# Altium schematic sheet COMS0013_Top_Schematic.SchDoc: Communications Top Level Schematic
size A3; Engineer: A. Shaw; DocumentNumber: COMS0013; Version: 1.0; Description: Overview of the communications subsystem
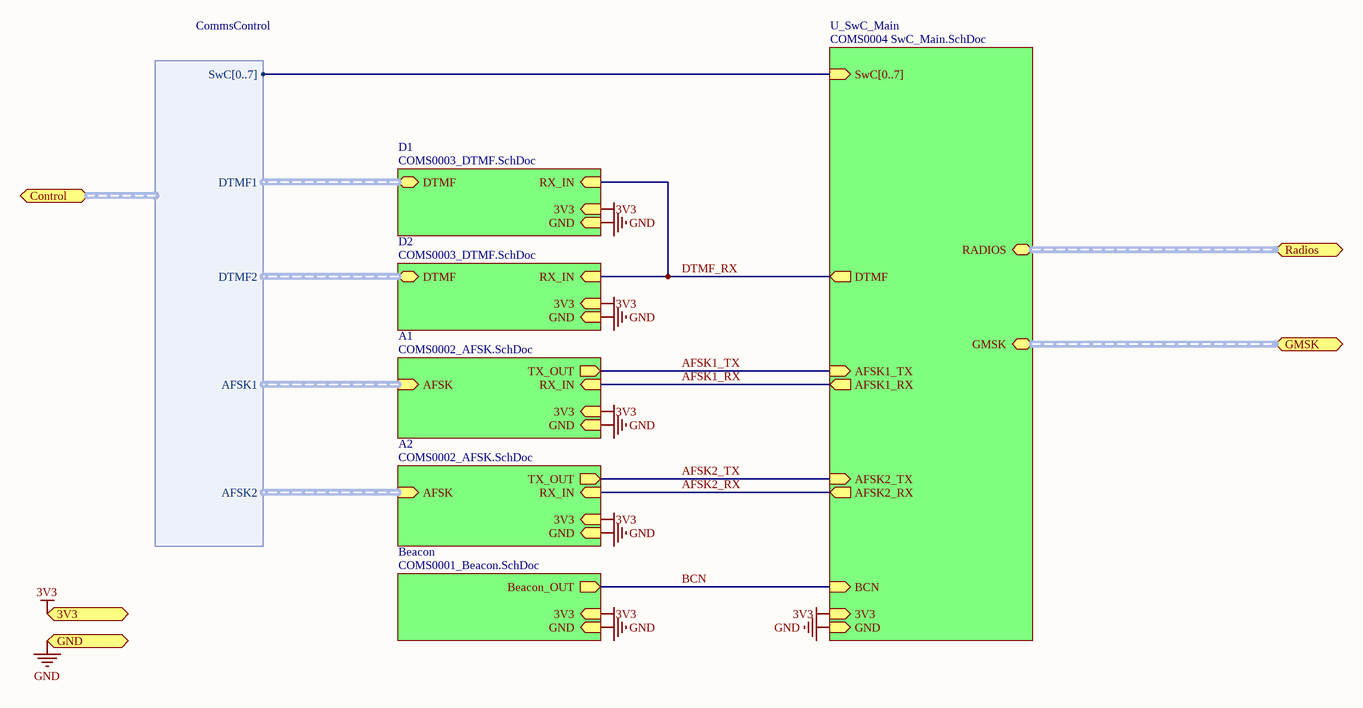
[diagram p0: COMS0013_Top_Schematic.SchDoc]

## Sub-sheets
A1 = COMS0002_AFSK.SchDoc: RX_IN (in), AFSK (harness AFSK), TX_OUT (out), 3V3 (in), GND (in)
A2 = COMS0002_AFSK.SchDoc: RX_IN (in), AFSK (harness AFSK), TX_OUT (out), 3V3 (in), GND (in)
Beacon = COMS0001_Beacon.SchDoc: Beacon_OUT (out), 3V3 (in), GND (in)
D1 = COMS0003_DTMF.SchDoc: RX_IN (in), DTMF (harness DTMF), 3V3 (in), GND (in)
D2 = COMS0003_DTMF.SchDoc: RX_IN (in), DTMF (harness DTMF), 3V3 (in), GND (in)
U_SwC_Main = COMS0004 SwC_Main.SchDoc: BCN (in), AFSK1_TX (in), AFSK2_TX (in), AFSK1_RX (out), AFSK2_RX (out), DTMF (out), SwC[0..7] (in), RADIOS (harness Radios), GMSK (harness GMSK), 3V3 (in), GND (in)

## Ports
3V3 (in), Control (harness CommsControl), GMSK (harness GMSK), GND (in), Radios (harness Radios)

## Harnesses
CommsControl: DTMF1, DTMF2, AFSK1, AFSK2, SwC[0..7]

## Nets
3V3: port 3V3, sheet D1/3V3, sheet D2/3V3, sheet Beacon/3V3, sheet U_SwC_Main/3V3, sheet A1/3V3, sheet A2/3V3
GND: port GND, sheet D1/GND, sheet D2/GND, sheet Beacon/GND, sheet U_SwC_Main/GND, sheet A1/GND, sheet A2/GND
AFSK1_RX: sheet U_SwC_Main/AFSK1_RX, sheet A1/RX_IN
AFSK1_TX: sheet U_SwC_Main/AFSK1_TX, sheet A1/TX_OUT
AFSK2_RX: sheet U_SwC_Main/AFSK2_RX, sheet A2/RX_IN
AFSK2_TX: sheet U_SwC_Main/AFSK2_TX, sheet A2/TX_OUT
BCN: sheet Beacon/Beacon_OUT, sheet U_SwC_Main/BCN
DTMF_RX: sheet D1/RX_IN, sheet D2/RX_IN, sheet U_SwC_Main/DTMF

## Buses and harness runs
harness port GMSK = sheet U_SwC_Main/GMSK
harness port Radios = sheet U_SwC_Main/RADIOS

## Notes on the sheet
- Title
- Description:
- Size:
- Author:
- Date:
- A3
- Time:
- Version
- Sheet:
- Drawing No.:
- of
- File: